# Altium schematic sheet Analog Relay.schdoc: Analog Relay
size A4; Organization: Altium Limited; Address1: L3, 12a Rodborough Rd; Address2: Frenchs Forest; Address3: NSW; Address4: Australia 2086; DocumentNumber: 1; SheetNumber: 1; SheetTotal: 1
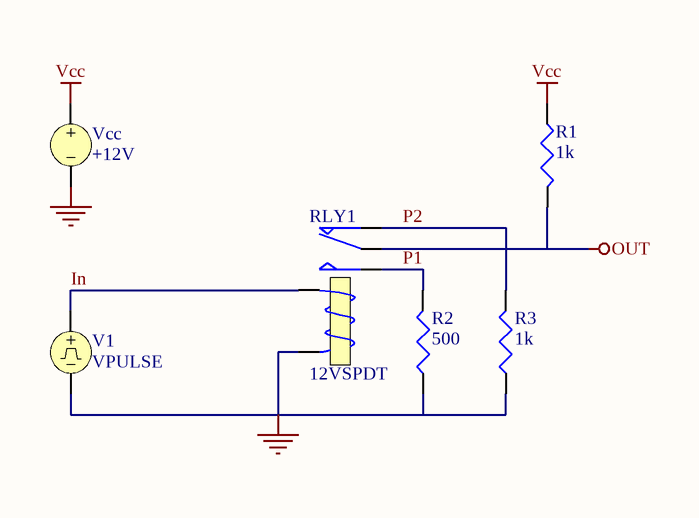
[diagram p0: Analog Relay.schdoc]

## Parts
R1  1k
R2  500
R3  1k
RLY1  12VSPDT
V1  VPULSE
Vcc  +12V

## Nets
GND: R2.2(BOT) R3.2(BOT) RLY1.5 V1.2 Vcc.2
OUT: R1.1(TOP) RLY1.1
Vcc: R1.2(BOT) Vcc.1
In: RLY1.4 V1.1
P1: R2.1(TOP) RLY1.3
P2: R3.1(TOP) RLY1.2

## Notes on the sheet
- Title
- Size:
- Date:
- A4
- Number:
- Time:
- Revision:
- Sheet
- of
- File:

## Library data of the parts
R1-R3 = RES: Resistor
  R1 R3: Value: 1k
  R2: Value: 500
RLY1 = 12VSPDT: SPDT Relay
V1 = VPULSE: Pulse Voltage Source
Vcc = VSRC: Voltage Source; Value: +12V